# Altium schematic sheet 30s-60s计时器.SchDoc
size 254 x 121 mm
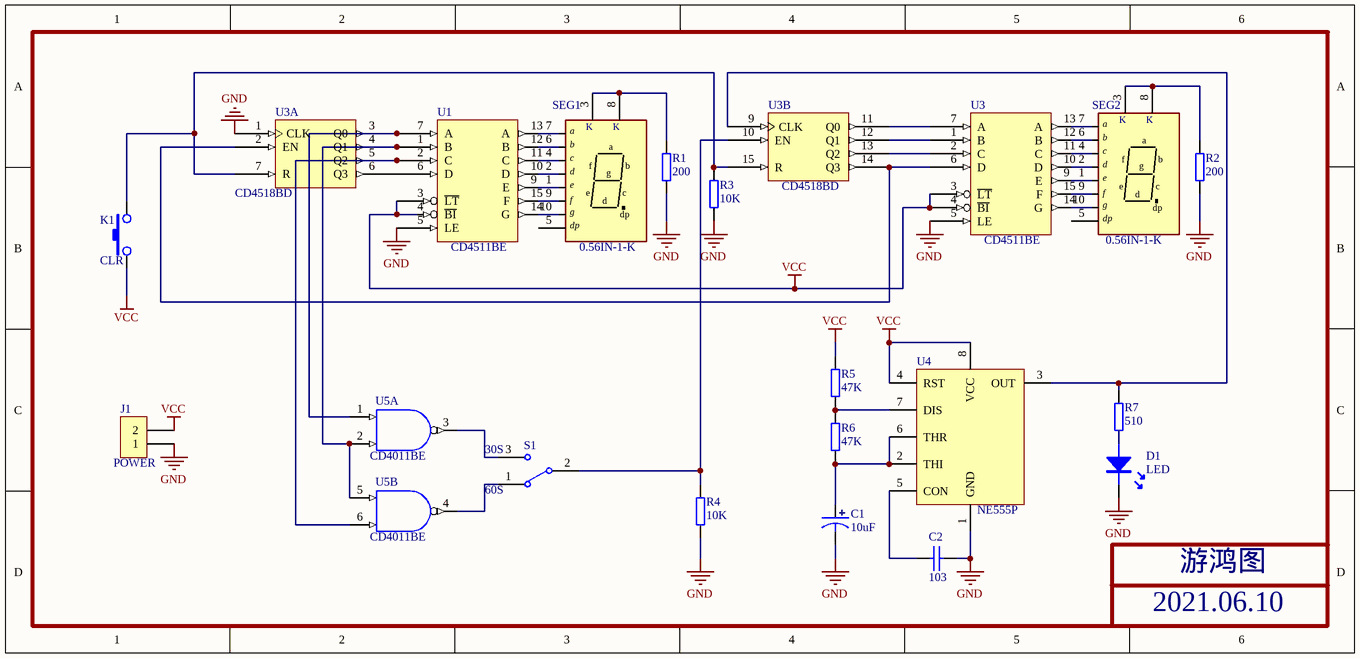
[diagram p0: 30s-60s计时器.SchDoc]

## Parts
(Parts that share a designator on the sheet are numbered #1, #2 ... from top to bottom, then left to right.)
C1  10uF  [DIP-EC1.5X4X8]
C2  103  [0201C]
D1  LED  [LED5-BLUE]
J1  POWER  [Pin HDR1X2/2.54mm-S]
K1  CLR  [DIP-3X6X4.3]
R1  200  [0201R]
R2  200  [0201R]
R3  10K  [0201R]
R4  10K  [0201R]
R5  47K  [0201R]
R6  47K  [0201R]
R7  510  [0201R]
S1  SS-12D10  [SS-12D10]  (value not drawn)
SEG1  0.56IN-1-K  [0.56IN-1P]
SEG2  0.56IN-1-K  [0.56IN-1P]
U1  CD4511BE  [DIP-16]
U3#1  CD4511BE  [DIP-16]
U3#2  CD4518BD  [DIP-16]  (parts A,B of 2)
U4  NE555P  [SOP8]
U5  CD4011BE  [DIP-14]  (parts A,B of 4)

## Nets
GND: C1.2 C2.2 D1.K J1.1 R1.2 R2.2 R3.1 R4.1 U1.5(LE) U1.8(GND) U3#1.5(LE) U3#1.8(GND) U3#2.1(CLK) U3#2.8(GND) U4.1(GND) U5.7(GND)
VCC: J1.2 K1.1 R5.2 U1.3(~{LT}) U1.4(~{BI}) U1.16(VCC) U3#1.3(~{LT}) U3#1.4(~{BI}) U3#1.16(VCC) U3#2.16(VCC) U4.4(RST) U4.8(VCC)
VDD: U5.14(VDD)
NetC1_1: C1.1 R6.1 U4.2(THI) U4.6(THR)
NetC2_1: C2.1 U4.5(CON)
NetD1_A: D1.A R7.1
NetK1_3: K1.3 R3.2 U3#2.7(R) U3#2.15(R)
NetR1_1: R1.1 SEG1.3(VCC) SEG1.8
NetR2_1: R2.1 SEG2.3(VCC) SEG2.8
NetR4_2: R4.2 S1.2 U3#2.10(EN)
NetR5_1: R5.1 R6.2 U4.7(DIS)
NetR7_2: R7.2 U3#2.9(CLK) U4.3(OUT)
NetS1_1: S1.1 U5.4(Y)
NetS1_3: S1.3 U5.3(Y)
NetSEG1_1: SEG1.1 U1.9(E)
NetSEG1_2: SEG1.2 U1.10(D)
NetSEG1_4: SEG1.4 U1.11(C)
NetSEG1_6: SEG1.6 U1.12(B)
NetSEG1_7: SEG1.7 U1.13(A)
NetSEG1_9: SEG1.9 U1.15(F)
NetSEG1_10: SEG1.10 U1.14(G)
NetSEG2_1: SEG2.1 U3#1.9(E)
NetSEG2_2: SEG2.2 U3#1.10(D)
NetSEG2_4: SEG2.4 U3#1.11(C)
NetSEG2_6: SEG2.6 U3#1.12(B)
NetSEG2_7: SEG2.7 U3#1.13(A)
NetSEG2_9: SEG2.9 U3#1.15(F)
NetSEG2_10: SEG2.10 U3#1.14(G)
NetU1_1: U1.1(B) U3#2.4(Q1) U5.2(B) U5.5(A)
NetU1_2: U1.2(C) U3#2.5(Q2) U5.6(B)
NetU1_6: U1.6(D) U3#2.6(Q3)
NetU1_7: U1.7(A) U3#2.3(Q0) U5.1(A)
NetU3#1_1: U3#1.1(B) U3#2.12(Q1)
NetU3#1_2: U3#1.2(C) U3#2.13(Q2)
NetU3#1_6: U3#1.6(D) U3#2.2(EN) U3#2.14(Q3)
NetU3#1_7: U3#1.7(A) U3#2.11(Q0)

Not connected (* = marked no-connect by the designer): SEG1 5; SEG2 5

## Notes on the sheet
- (near S1) 30S
- (near S1) 60S
- 游鸿图
- 2021.06.10
- (in symbol 0.56IN-1-K) K; a; b; c; f; d; g; e; dp

## Library data of the parts
C1 = DIP_ECAP: 直插电解电容
C2 = CAP: 无极性电容
J1 = Pin HDR1X2
K1 = KEY
R1-R7 = RES: 电阻
SEG1 SEG2 = 0.56IN-1-K: 1位0.56寸共阴数码管
U1 U3#1 = 4511
U3#2 = 4518
U4 = NE555
U5 = 4011: Quad 2-Input NAND Gate